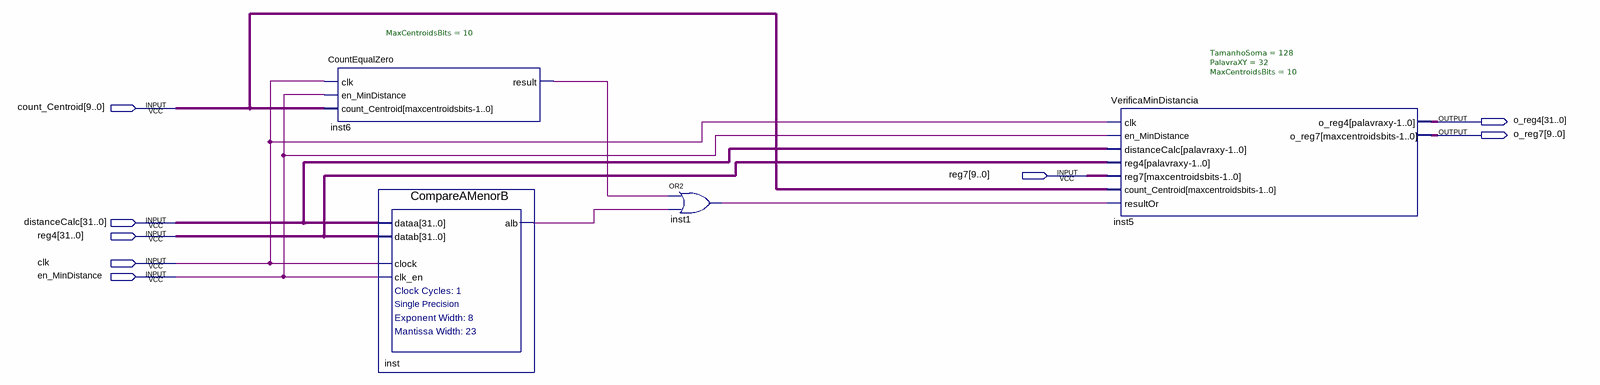
[diagram p0: schematic sheet]
// Quartus schematic MinDistanceFP.bdf as structural Verilog: 4 symbols, 8 pins
module MinDistanceFP (
  input  [9:0] count_Centroid,
  input  [9:0] reg7,
  input  [31:0] distanceCalc,
  input  [31:0] reg4,
  input  clk,
  input  en_MinDistance,
  output [31:0] o_reg4,
  output [9:0] o_reg7
);

  wire inst1_out, inst6_result, inst_alb;

  CountEqualZero #(.MaxCentroidsBits(10)) inst6 (
    .clk(clk), .en_MinDistance(en_MinDistance), .count_Centroid(count_Centroid), .result(inst6_result));
  CompareAMenorB inst (.dataa(distanceCalc), .datab(reg4), .clock(clk), .clk_en(en_MinDistance), .alb(inst_alb));
  or inst1 (inst1_out, inst6_result, inst_alb);
  VerificaMinDistancia #(.TamanhoSoma(128), .PalavraXY(32), .MaxCentroidsBits(10)) inst5 (
    .clk(clk), .en_MinDistance(en_MinDistance), .distanceCalc(distanceCalc), .reg4(reg4), .reg7(reg7),
    .count_Centroid(count_Centroid), .resultOr(inst1_out), .o_reg4(o_reg4), .o_reg7(o_reg7));
endmodule
